# EAGLE design ATTAMI-Shield-Servo (EAGLE 7.1.0)
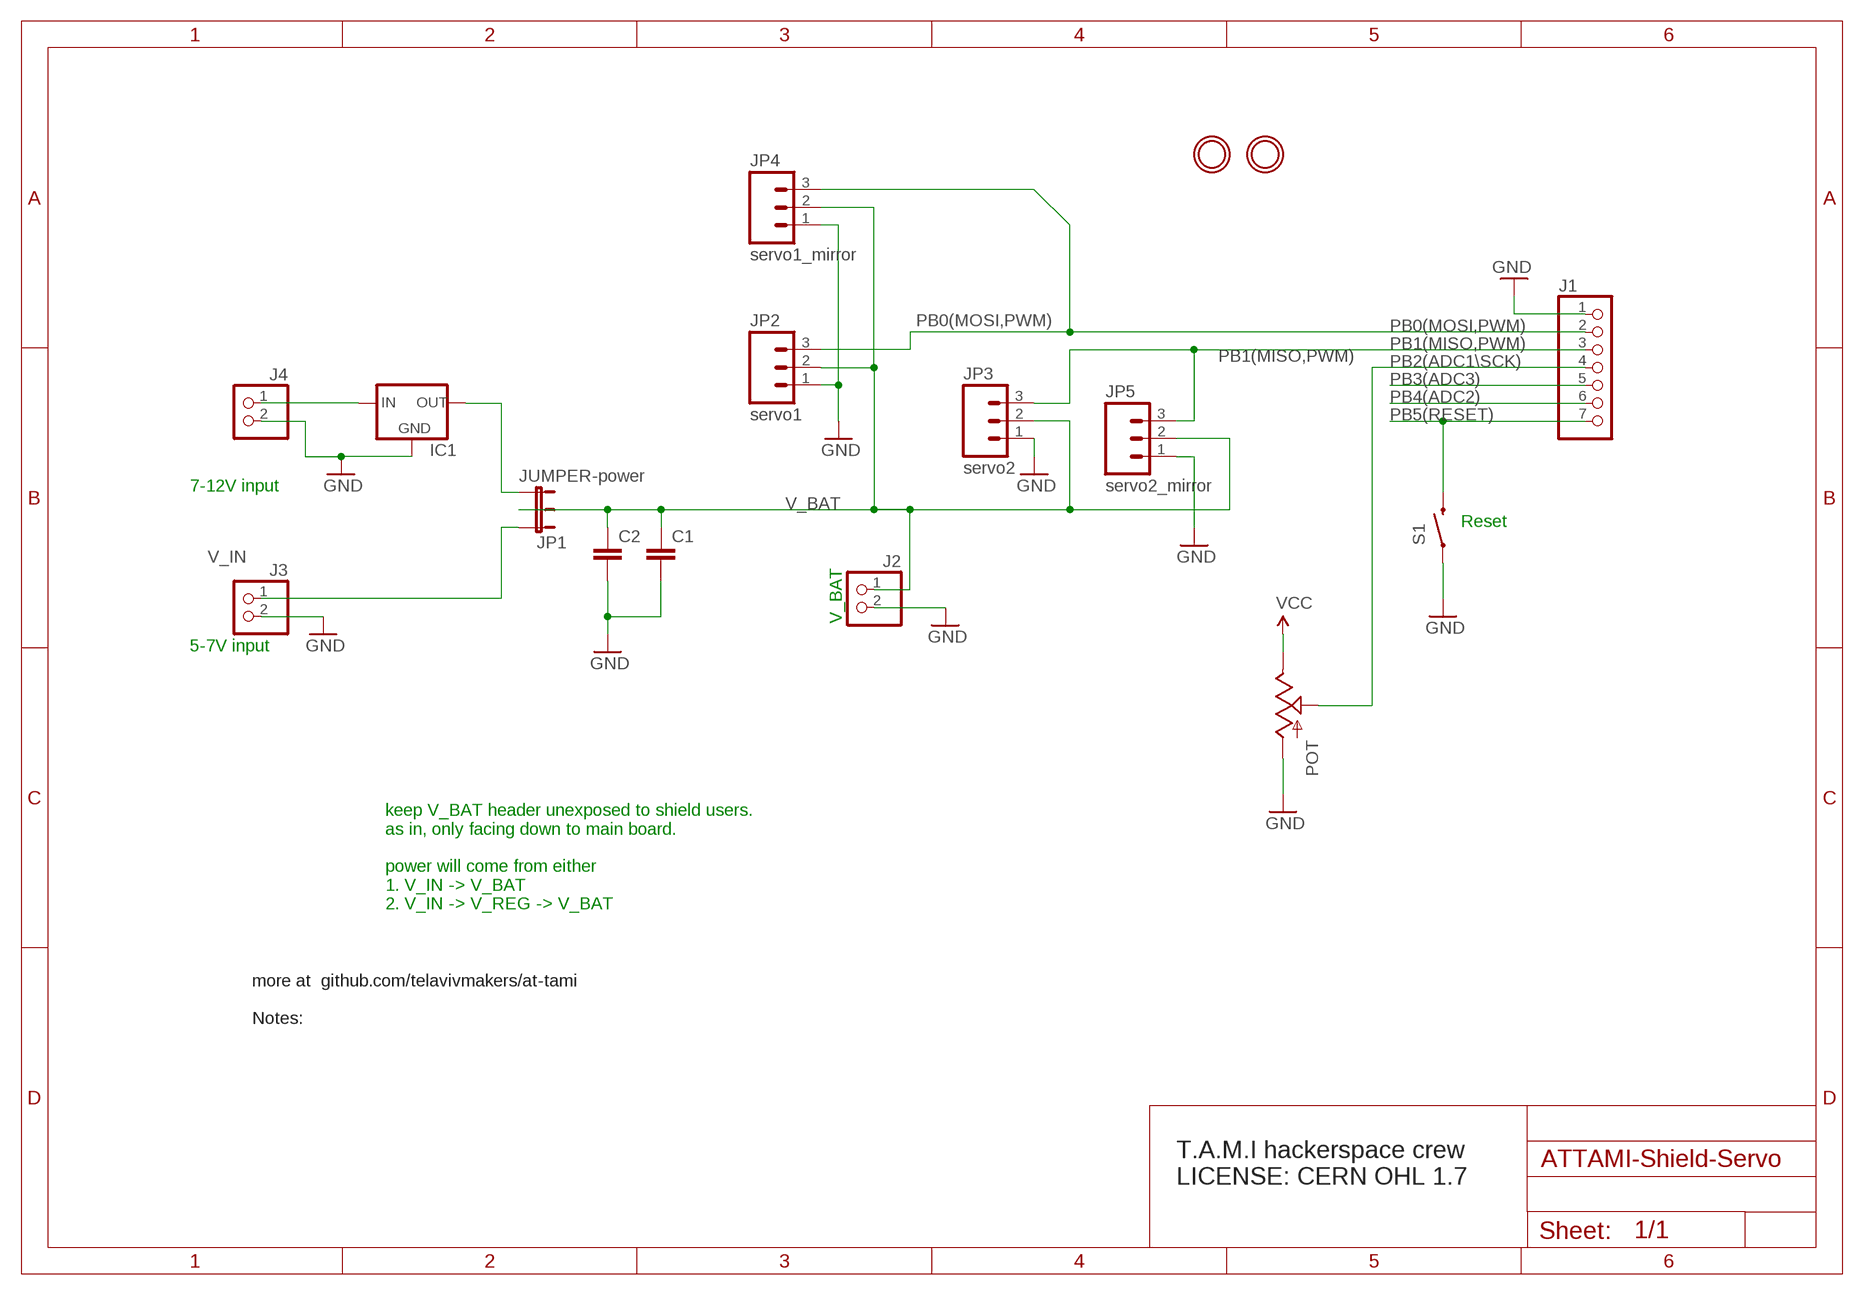
[diagram p0: schematic, sheet 1]

## Parts
C1  CAPKIT  [CAP-PTH-SMALL-KIT]
C2  CAPKIT  [CAP-PTH-SMALL-KIT]
IC1  V_REG_78XXSINK  [TO220-IGO]
J1  HEADER-1X7ROUND  [1X07_ROUND]
J2  HEADER-1X2ROUND  [1X02_ROUND]
J3  HEADER-1X2ROUND  [1X02_ROUND]
J4  HEADER-1X2ROUND  [1X02_ROUND]
JP1  JUMPER-power  JUMPER-3PTH  [1X03]
JP2  servo1  M03LONGPADS  [1X03_LONGPADS]
JP3  servo2  M03LONGPADS  [1X03_LONGPADS]
JP4  servo1_mirror  M03LONGPADS  [1X03_LONGPADS]
JP5  servo2_mirror  M03LONGPADS  [1X03_LONGPADS]
POT  POT100K_3362U  [3362U]
S1  SWITCH-MOMENTARY-2-SMD-1101NE  [TACTILE-SWITCH-1101NE]
U$1  MOUNTINGHOLE2.0  [MOUNTINGHOLE_2.0_PLATED]
U$2  MOUNTINGHOLE2.0  [MOUNTINGHOLE_2.0_PLATED]

## Nets
GND: C1.2 C2.2 IC1.GND J1.1 J2.2 J3.2 J4.2 JP2.1 JP3.1 JP4.1 JP5.1 POT.P$3(A) S1.P$1
N$1: IC1.IN J4.1
N$3: IC1.OUT JP1.3
PB0(MOSI,PWM): J1.2 JP2.3 JP4.3
PB1(MISO,PWM): J1.3 JP3.3 JP5.3
PB2(ADC1\SCK): J1.4 POT.P$2(S)
PB3(ADC3): J1.5
PB4(ADC2): J1.6
PB5(RESET): J1.7 S1.P$2
V_BAT: C1.1 C2.1 J2.1 JP1.2 JP2.2 JP3.2 JP4.2 JP5.2
V_IN: J3.1 JP1.1
VCC: POT.P$1(E)

## Notes on the sheet
- 7-12V input
- Reset
- V_BAT
- 5-7V input
- keep V_BAT header unexposed to shield users.
  as in, only facing down to main board.
  
  power will come from either 
  1. V_IN -> V_BAT
  2. V_IN -> V_REG -> V_BAT
- more at  github.com/telavivmakers/at-tami
  
  Notes:
- T.A.M.I hackerspace crew 
  LICENSE: CERN OHL 1.7

## Library data of the parts
C1 C2 = SparkFun-Capacitors:CAP: Capacitor Standard 0603 ceramic capacitor, and 0.1" leaded capacitor.
IC1 = SparkFun-PowerIC:V_REG_78XX: Voltage Regulator Standard 7805 5V regulator. IGO (Input Ground Output). Spark Fun Electronics SKU : COM-00107
J1 = microbuilder:HEADER-1X7: PIN HEADER
J2-J4 = microbuilder:HEADER-1X2: PIN HEADER
JP1 = SparkFun-Passives:JUMPER-3
JP2-JP5 = SparkFun-Connectors:M03: Header 3 Standard 3-pin 0.1" header. Use with straight break away headers (SKU : PRT-00116), right angle break away headers (PRT-00553), swiss pins (PRT-00743), machine pins (PRT-00117), and female headers (PRT-00115). Molex polarized connector foot print use with SKU : PRT-08232 with associated crimp pins and housings.
POT = SparkFun-Electromechanical:POT
S1 = SparkFun-Electromechanical:SWITCH-MOMENTARY-2: Various NO switches- pushbuttons, reed, etc
U$1 U$2 = microbuilder:MOUNTINGHOLE: Mounting Hole For #2 screws (0.086"/2.18mm width, 0.094"/2.4mm hole) use 2.5mm

## Net classes
0 default: width 0.203 mm
1 vcc: width 0.254 mm

## Board
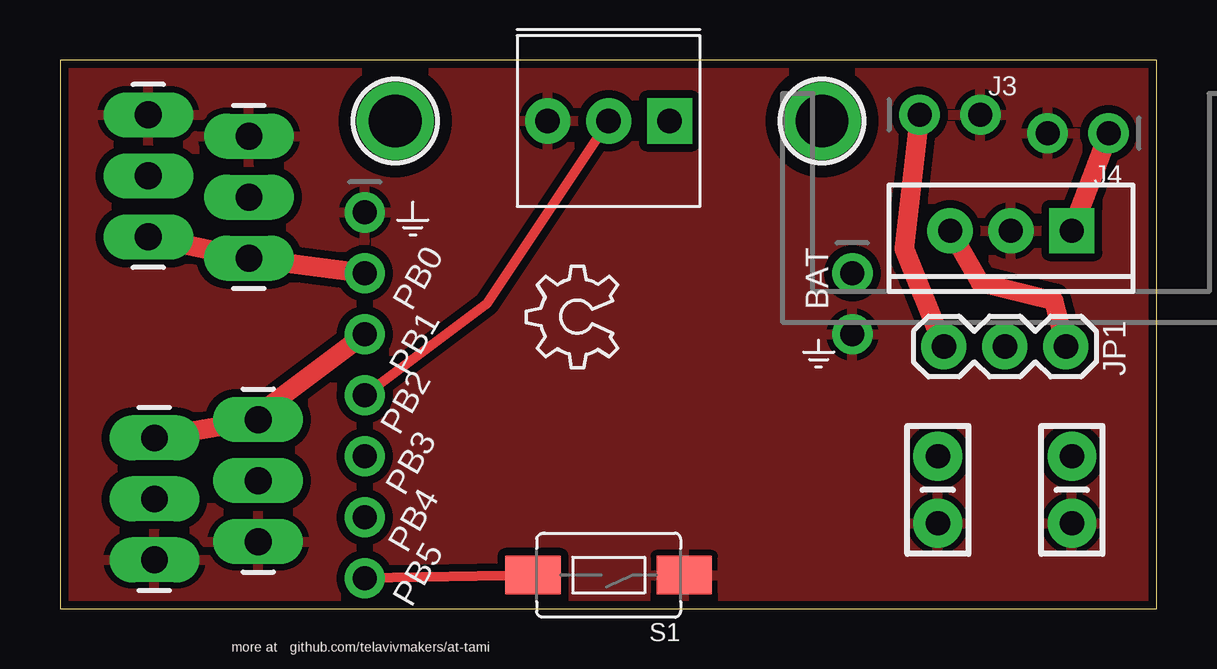
[diagram p1: board, top side]
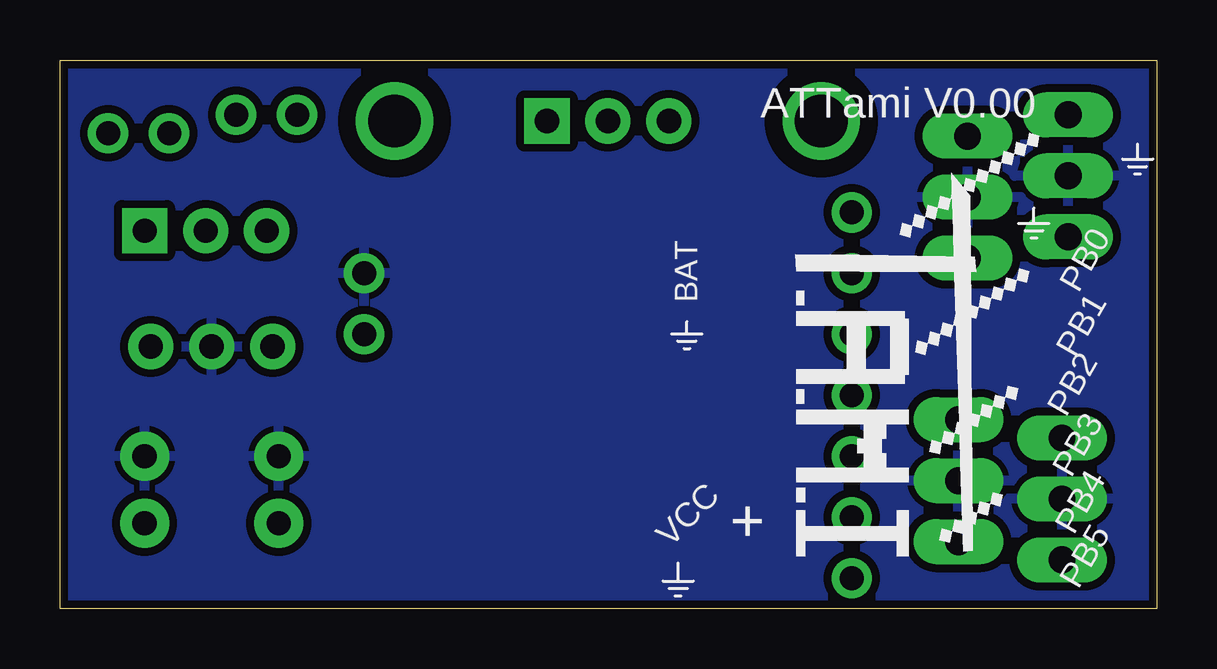
[diagram p2: board, bottom side, seen from below]

Size 45.69 x 22.86 mm. Coordinates in mm from the lower left corner, seen from the top.
Outline: 0,0 45.69,0 45.69,22.86 0,22.86 0,0
Copper layers (1*16): Top 0.035mm / dielectric 1.5mm / Bottom 0.035mm
Design rules "dirt_cheap_dirty_boards.v1": minimum track width 5mil, minimum drill 12mil, track to track 5mil, track to pad 5mil, pad to pad 5mil, via to via 5mil, smd to smd 0mil, copper to edge 10mil, drill to drill 10mil, minimum pad ring 10mil, minimum via ring 6mil, stop-mask expansion 2mil, vias tented up to drill 25mil, thermal gap 10mil

### Footprints (pad centres in the part's own frame; a part is rotated, then mirrored left to right if it is on the bottom)
CAP-PTH-SMALL-KIT = drill 1.016 pad 2.032: 1 -1.397,0; 2 1.397,0
TO220-IGO = drill 1 pad 1.88: GND 0,0; OUT 2.54,0 | drill 1 pad 1.88 square: IN -2.54,0
1X07_ROUND = drill 1 pad 1.676: 1 -7.62,0; 2 -5.08,0; 3 -2.54,0; 4 0,0; 5 2.54,0; 6 5.08,0; 7 7.62,0
1X02_ROUND = drill 1 pad 1.676: 1 -1.27,0; 2 1.27,0
1X03 = drill 1.016 pad 1.88: 1 0,0; 2 2.54,0; 3 5.08,0
1X03_LONGPADS = drill 1.118 pad 1.88 long: 1 0,0; 2 2.54,0; 3 5.08,0
3362U = drill 1.016 pad 1.88 square: P$1 0,2.54 | drill 1.016 pad 1.88: P$2 2.54,2.54; P$3 5.08,2.54
TACTILE-SWITCH-1101NE = smd 2.3 x 1.6: P$1 -3.15,0; P$2 3.15,0
MOUNTINGHOLE_2.0_PLATED = drill 2.2 pad 3: P$1 0,0

### Placement (x,y rotation side)
C1  36.58,4.95 270 top
C2  42.16,4.95 270 top
IC1  39.62,15.75 180 top
J1  12.7,8.89 270 top
J2  33.02,12.7 270 top
J3  37.08,20.57 0 top
J4  42.42,19.81 180 top
JP1  36.83,10.92 0 top
JP2  3.68,20.57 270 top
JP3  8.26,2.79 90 top
JP4  7.87,19.68 270 top
JP5  3.94,2.03 90 top
POT  25.4,22.86 180 top
S1  22.86,1.4 180 top
U$1  13.97,20.32 270 top
U$2  31.75,20.32 0 top
U$3  [OSHW_6X150_NOTEXT]  23.24,10.03 90 top

### Tracks (layer width: path | path; a pad name or v marks a point on that pad's centre or on a via)
GND
  pour Top (isolate 0.33): -0.89,23.24 -1.02,-0.51 46.1,-0.89 46.16,23.14
N$1
  Top 0.813: J4.1 IC1.IN
N$3
  Top 0.813: IC1.OUT 38.35,13.59 41.4,12.83 JP1.3
PB0(MOSI,PWM)
  Top 0.813: J1.2 JP4.3 JP2.3
PB1(MISO,PWM)
  Top 0.813: J1.3 7.62,7.62 JP3.3 JP5.3
PB2(ADC1\SCK)
  Top 0.406: POT.P$2 17.78,12.7 J1.4
PB5(RESET)
  Top 0.406: S1.P$2 J1.7
V_BAT
  pour Bottom (isolate 0.33): 46.23,23.11 -1.02,23.24 -1.21,-1.43 45.97,-1.02
V_IN
  Top 0.813: J3.1 35.18,14.99 JP1.1

### Text on the board
tPlace: more at github.com/telavivmakers/at-tami
bPlace: BAT | PB0 | PB1 | PB2 | PB3 | PB4 | + | VCC | PB5
tNames: PB0 | BAT | PB1 | PB2 | PB3 | PB4 | PB5
bNames: ATTami V0.00
tTest: J2